# Altium project clock_led.PrjPcb
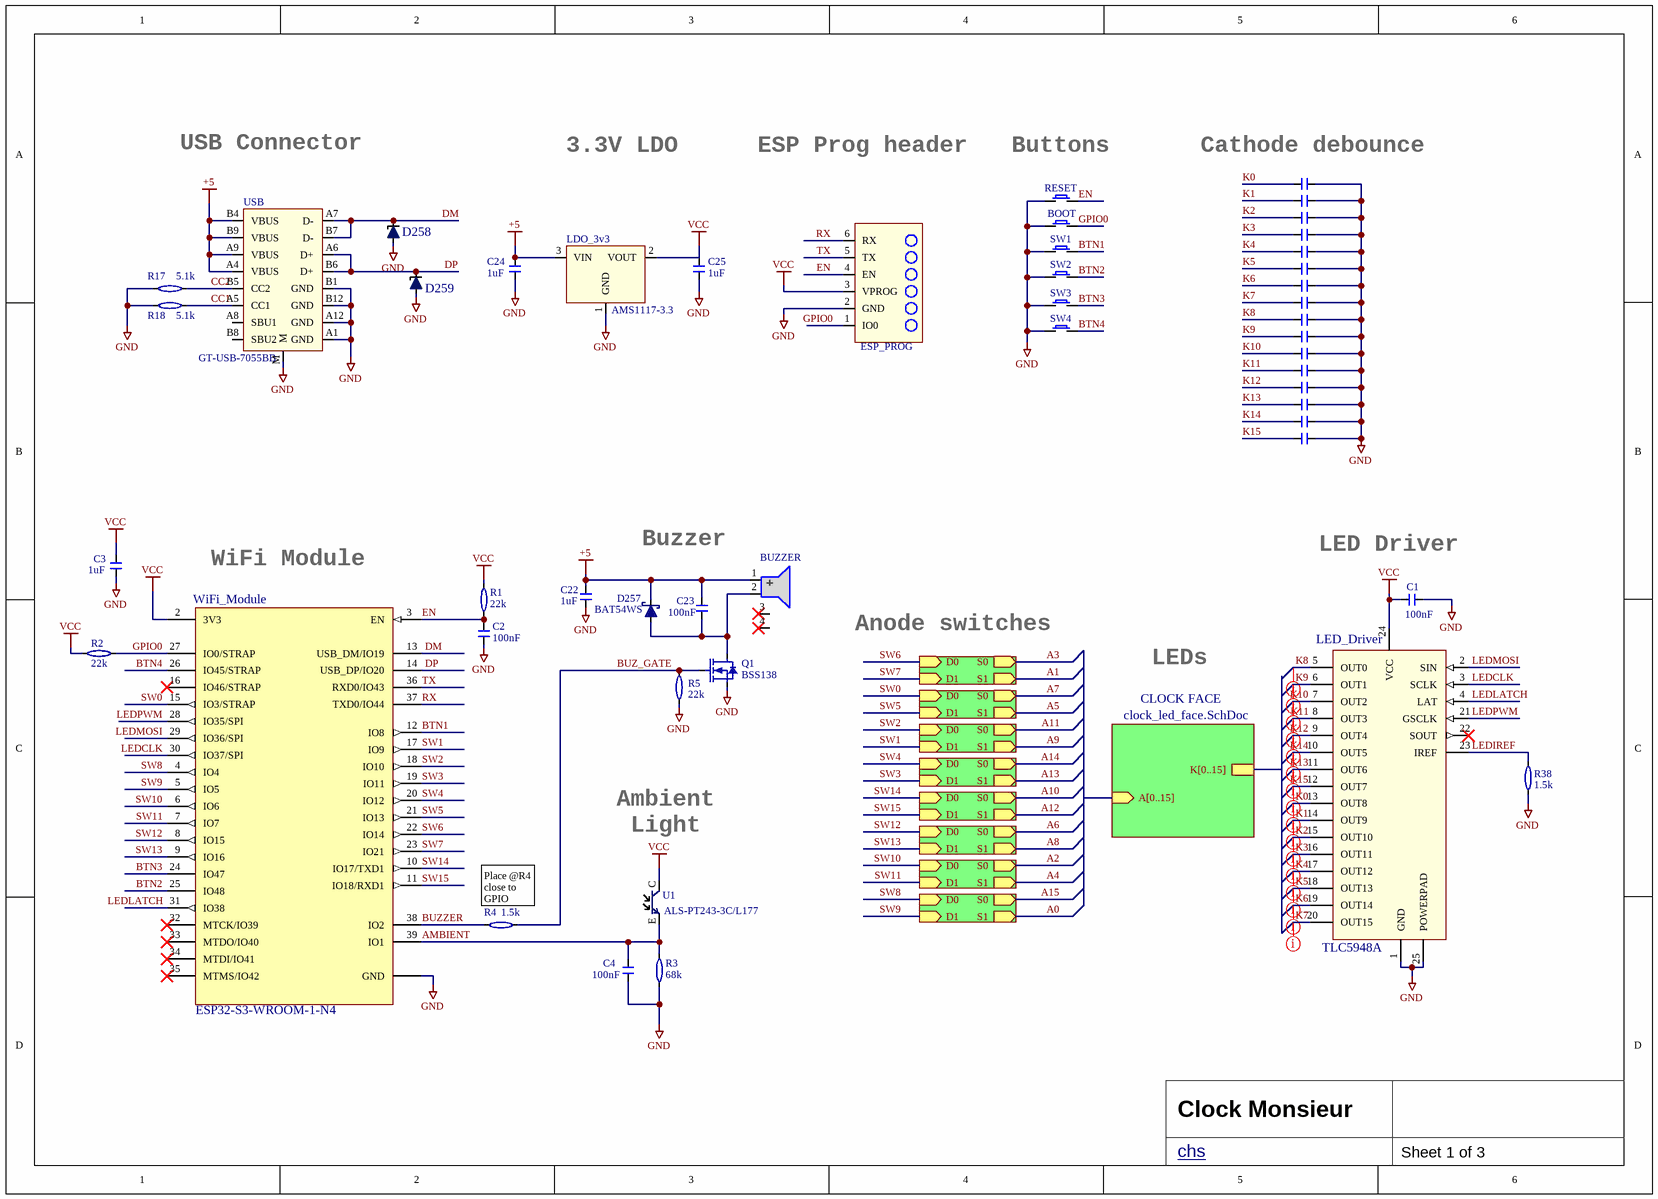
[diagram p0: clock_led.SchDoc]
3 sheets, 321 parts. Net scope: hierarchical (ports join the sheet entries above them; power ports are global).
Board files: clock_led.PcbDoc, clock_led_panel.PcbDoc
Sheets:
  clock_led.SchDoc
    CLOCK FACE = clock_led_face.SchDoc
    D = clock_led_dual_switch.SchDoc
    D = clock_led_dual_switch.SchDoc
    D = clock_led_dual_switch.SchDoc
    D = clock_led_dual_switch.SchDoc
    D = clock_led_dual_switch.SchDoc
    D = clock_led_dual_switch.SchDoc
    D = clock_led_dual_switch.SchDoc
    D = clock_led_dual_switch.SchDoc

## Sheet clock_led.SchDoc: Clock Monsieur
size 290 x 209 mm; Author: chs; SheetNumber: 1; SheetTotal: 3

### Parts
BOOT  SW-SMD_YZA-072-7.0  [FSM-SWITCH-6x6x7.0]  (value not drawn)
BUZZER  BUZZER_MLT-7525  [BUZZER_XHXDZ_SMD8530]  (value not drawn)
C1  100nF  [CAPC_0603_1608X08L]
C2  100nF  [CAPC_0603_1608X08L]
C3  1uF  [CAPC_1206_3216X16L]
C4  100nF  [CAPC_0603_1608X08L]
C5  100pF  [CAP_0402]  (value not drawn)
C6  100pF  [CAP_0402]  (value not drawn)
C7  100pF  [CAP_0402]  (value not drawn)
C8  100pF  [CAP_0402]  (value not drawn)
C9  100pF  [CAP_0402]  (value not drawn)
C10  100pF  [CAP_0402]  (value not drawn)
C11  100pF  [CAP_0402]  (value not drawn)
C12  100pF  [CAP_0402]  (value not drawn)
C13  100pF  [CAP_0402]  (value not drawn)
C14  100pF  [CAP_0402]  (value not drawn)
C15  100pF  [CAP_0402]  (value not drawn)
C16  100pF  [CAP_0402]  (value not drawn)
C17  100pF  [CAP_0402]  (value not drawn)
C18  100pF  [CAP_0402]  (value not drawn)
C19  100pF  [CAP_0402]  (value not drawn)
C20  100pF  [CAP_0402]  (value not drawn)
C22  1uF  [CAPC_1206_3216X16L]
C23  100nF  [CAPC_0603_1608X08L]
C24  1uF  [CAPC_1206_3216X16L]
C25  1uF  [CAPC_1206_3216X16L]
D257  BAT54WS  [SODFL250X100-2L]
D258  TVS_DIODE  [TVS_DIODE]  (value not drawn)
D259  TVS_DIODE  [TVS_DIODE]  (value not drawn)
ESP_PROG  ESP_PROG  [ESP_PROG]  (value not drawn)  (no BOM)
LDO_3v3  AMS1117-3.3  [SOT223_LDO]
LED_Driver  TLC5948A  [TSSOP24]
Q1  BSS138  [SOT95P230X110-3L]
R1  22k  [RES 0402_1005 RF]
R2  22k  [RES 0402_1005 RF]
R3  68k  [RES 0402_1005 RF]
R4  1.5k  [RES 0402_1005 RF]
R5  22k  [RES 0402_1005 RF]
R17  5.1k  [RES 0402_1005 RF]
R18  5.1k  [RES 0402_1005 RF]
R38  1.5k  [RES 0402_1005 RF]
RESET  SW-SMD_YZA-072-5.5  [FSM-SWITCH-6x6x5.5]  (value not drawn)
SW1  SW-SMD_YZA-072-7.0  [FSM-SWITCH-6x6x7.0]  (value not drawn)
SW2  SW-SMD_YZA-072-7.0  [FSM-SWITCH-6x6x7.0]  (value not drawn)
SW3  SW-SMD_YZA-072-7.0  [FSM-SWITCH-6x6x7.0]  (value not drawn)
SW4  SW-SMD_YZA-072-7.0  [FSM-SWITCH-6x6x7.0]  (value not drawn)
U1  ALS-PT243-3C/L177  [ALS-PT243-3C]  (no BOM)
USB  GT-USB-7055BB  [USB-C-TH_GT-USB-7055BB]
WiFi_Module  ESP32-S3-WROOM-1-N4  [XCVR_ESP32-S3-WROOM-1-N16R2]

### Sub-sheets
CLOCK FACE = clock_led_face.SchDoc: A[0..15] (in), K[0..15]
D = clock_led_dual_switch.SchDoc: D0 (in), D1 (in), S0 (out), S1 (out)
D = clock_led_dual_switch.SchDoc: D0 (in), D1 (in), S0 (out), S1 (out)
D = clock_led_dual_switch.SchDoc: D0 (in), D1 (in), S0 (out), S1 (out)
D = clock_led_dual_switch.SchDoc: D0 (in), D1 (in), S0 (out), S1 (out)
D = clock_led_dual_switch.SchDoc: D0 (in), D1 (in), S0 (out), S1 (out)
D = clock_led_dual_switch.SchDoc: D0 (in), D1 (in), S0 (out), S1 (out)
D = clock_led_dual_switch.SchDoc: D0 (in), D1 (in), S0 (out), S1 (out)
D = clock_led_dual_switch.SchDoc: D0 (in), D1 (in), S0 (out), S1 (out)

### Nets
+5: BUZZER.1(VCC) C22.1 C23.1 C24.2 D257.K LDO_3v3.3(VIN) USB.A4(VBUS) USB.A9(VBUS) USB.B4(VBUS) USB.B9(VBUS)
GND: BOOT.1(A) C1.1 C2.2 C3.2 C4.2 C5.1 C6.1 C7.1 C8.1 C9.1 C10.1 C11.1 C12.1 C13.1 C14.1 C15.1 C16.1 C17.1 C18.1 C19.1 C20.1 C22.2 C24.1 C25.2 D258.A D259.A ESP_PROG.2(GND) LDO_3v3.1(GND) LED_Driver.1(GND) LED_Driver.25(POWERPAD) Q1.S R3.2 R5.2 R17.2 R18.2 R38.2 RESET.1(A) SW1.1(A) SW2.1(A) SW3.1(A) SW4.1(A) USB.A1(GND) USB.A12(GND) USB.B1(GND) USB.B12(GND) USB.M WiFi_Module.GND
VCC: C1.2 C3.1 C25.1 ESP_PROG.3(VPROG) LDO_3v3.2(VOUT) LED_Driver.24(VCC) R1.1 R2.1 U1.C WiFi_Module.2(3V3)
AMBIENT: C4.1 R3.1 U1.E WiFi_Module.39(IO1)
BTN1: SW1.2(B) WiFi_Module.12(IO8)
BTN2: SW2.2(B) WiFi_Module.25(IO48)
BTN3: SW3.2(B) WiFi_Module.24(IO47)
BTN4: SW4.2(B) WiFi_Module.26(IO45/STRAP)
BUZ_GATE: Q1.G R4.1 R5.1
BUZZER: R4.2 WiFi_Module.38(IO2)
CC1: R18.1 USB.A5(CC1)
CC2: R17.1 USB.B5(CC2)
DM: D258.K USB.A7(D-) USB.B7(D-) WiFi_Module.13(USB_DM/IO19)
DP: D259.K USB.A6(D+) USB.B6(D+) WiFi_Module.14(USB_DP/IO20)
EN: C2.1 ESP_PROG.4(EN) R1.2 RESET.2(B) WiFi_Module.3(EN)
GPIO0: BOOT.2(B) ESP_PROG.1(IO0) R2.2 WiFi_Module.27(IO0/STRAP)
K0: C5.2 LED_Driver.13(OUT8)
K1: C6.2 LED_Driver.14(OUT9)
K2: C7.2 LED_Driver.15(OUT10)
K3: C8.2 LED_Driver.16(OUT11)
K4: C9.2 LED_Driver.17(OUT12)
K5: C10.2 LED_Driver.18(OUT13)
K6: C11.2 LED_Driver.19(OUT14)
K7: C12.2 LED_Driver.20(OUT15)
K8: C13.2 LED_Driver.5(OUT0)
K9: C14.2 LED_Driver.6(OUT1)
K10: C15.2 LED_Driver.7(OUT2)
K11: C16.2 LED_Driver.8(OUT3)
K12: C17.2 LED_Driver.9(OUT4)
K13: C18.2 LED_Driver.11(OUT6)
K14: C19.2 LED_Driver.10(OUT5)
K15: C20.2 LED_Driver.12(OUT7)
LEDCLK: LED_Driver.3(SCLK) WiFi_Module.30(IO37/SPI)
LEDIREF: LED_Driver.23(IREF) R38.1
LEDLATCH: LED_Driver.4(LAT) WiFi_Module.31(IO38)
LEDMOSI: LED_Driver.2(SIN) WiFi_Module.29(IO36/SPI)
LEDPWM: LED_Driver.21(GSCLK) WiFi_Module.28(IO35/SPI)
RX: ESP_PROG.6(RX) WiFi_Module.37(TXD0/IO44)
SW0: WiFi_Module.15(IO3/STRAP) ; sheet D/D0
SW1: WiFi_Module.17(IO9) ; sheet D/D1
SW2: WiFi_Module.18(IO10) ; sheet D/D0
SW3: WiFi_Module.19(IO11) ; sheet D/D1
SW4: WiFi_Module.20(IO12) ; sheet D/D0
SW5: WiFi_Module.21(IO13) ; sheet D/D1
SW6: WiFi_Module.22(IO14) ; sheet D/D0
SW7: WiFi_Module.23(IO21) ; sheet D/D1
SW8: WiFi_Module.4(IO4) ; sheet D/D0
SW9: WiFi_Module.5(IO5) ; sheet D/D1
SW10: WiFi_Module.6(IO6) ; sheet D/D0
SW11: WiFi_Module.7(IO7) ; sheet D/D1
SW12: WiFi_Module.8(IO15) ; sheet D/D0
SW13: WiFi_Module.9(IO16) ; sheet D/D1
SW14: WiFi_Module.10(IO17/TXD1) ; sheet D/D0
SW15: WiFi_Module.11(IO18/RXD1) ; sheet D/D1
TX: ESP_PROG.5(TX) WiFi_Module.36(RXD0/IO43)
NetBUZZER_2: BUZZER.2(GND) C23.2 D257.A Q1.D

Not connected (* = marked no-connect by the designer): BUZZER 3(DNC)* 4(DNC)*; LED_Driver 22(SOUT)*; USB A8(SBU1) B8(SBU2); WiFi_Module 16(IO46/STRAP)* 32(MTCK/IO39)* 33(MTDO/IO40)* 34(MTDI/IO41)* 35(MTMS/IO42)*

### Layout directives
net class CATHODES: K0, K1, K2, K3, K4, K5, K6, K7, K8, K9, K10, K11, K12, K13, K14, K15

### Notes on the sheet
- USB Connector
- 3.3V LDO
- ESP Prog header
- Buttons
- Cathode debounce
- (near WiFi_Module) WiFi Module
- Buzzer
- (near C1) LED Driver
- Anode switches
- LEDs
- Ambient Light Sensor
- (near R4) Place @R4 close to GPIO

### Library data of the parts
BOOT SW1-SW4 = SW-SMD_YZA-072-7.0: 5.2x5.2x1.2mm Tactile Switch; JLCPCB: C722968
C1 C4 C23 = CAP_0603_100nF: Ceramic capacitor 0603; Value: 100nF; JLCPCB: C7501158
C2 = CAP_0402_100nF: Ceramic capacitor 0402; Value: 100nF; JLCPCB: C7501158
C3 C22 C24 C25 = CAP_1206_1uF: Ceramic capacitor 1206; Value: 1uF; JLCPCB: C5448921
C5-C20 = CAP_0402_100pF: Ceramic capacitor 0402; Value: 100pF; JLCPCB: C1546
D257 = BAT54WS: Schottky Diode 20v 500mA; JLCPCB: C27636123
D258 D259 = TVS_DIODE: TVS Diode; JLCPCB: C151980
LDO_3v3 = AMS1117-3.3: 3.3V LDO; JLCPCB: C18906017
LED_Driver = TLC5948: 16 Channel CC Led Driver; JLCPCB: C702084
Q1 = BSS138: P channel mosfet 1.2A; JLCPCB: C3015220
R1 R2 R5 = RES_0402_22k: Chip Resistor; Value: 22k; JLCPCB: C2906913
R3 = RES_0402_68k: Chip Resistor; Value: 68k; JLCPCB: C3017593
R4 R38 = RES_0402_1.5k: Chip Resistor; Value: 1.5k; JLCPCB: C2933074
R17 R18 = RES_0402_5.1k: Chip Resistor; Value: 5.1k; JLCPCB: C2906948
RESET = SW-SMD_YZA-072-5.5: 5.2x5.2x1.2mm Tactile Switch; JLCPCB: C722967
U1 = PHOTOTRANSISTOR
USB = GT-USB-7055BB: USB Connector, vertical; JLCPCB: C7450621
WiFi_Module = ESP32-S3-WROOM-1-N4: ESP32 Module, 4MB Flash, No PSRAM; JLCPCB: C2913197
BUZZER = BUZZER_MLT-7525: JLCPCB: C95299

## Sheet clock_led_face.SchDoc: Display
size 290 x 209 mm; Author: chs; SheetNumber: 3; SheetTotal: 3
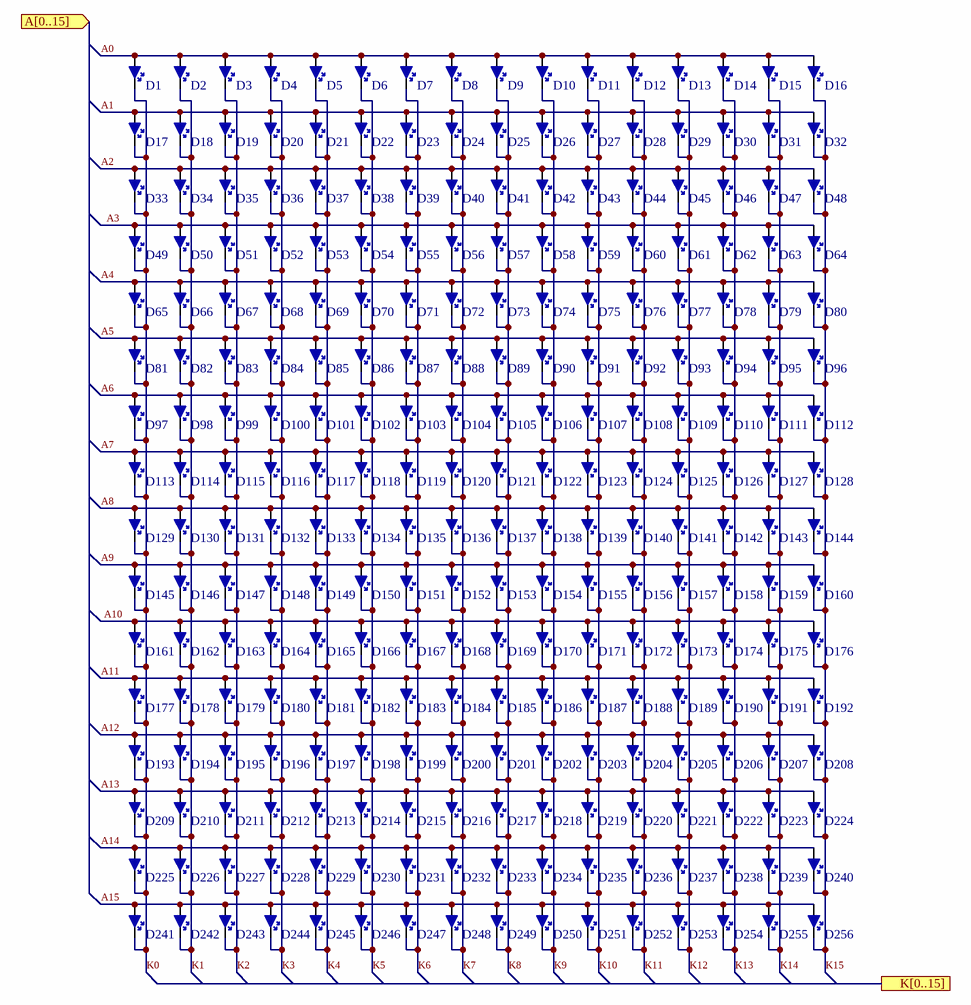
[diagram p1: clock_led_face.SchDoc]

### Parts
D1  LED  [LED_0402]  (value not drawn)
D2  LED  [LED_0402]  (value not drawn)
D3  LED  [LED_0402]  (value not drawn)
D4  LED  [LED_0402]  (value not drawn)
D5  LED  [LED_0402]  (value not drawn)
D6  LED  [LED_0402]  (value not drawn)
D7  LED  [LED_0402]  (value not drawn)
D8  LED  [LED_0402]  (value not drawn)
D9  LED  [LED_0402]  (value not drawn)
D10  LED  [LED_0402]  (value not drawn)
D11  LED  [LED_0402]  (value not drawn)
D12  LED  [LED_0402]  (value not drawn)
D13  LED  [LED_0402]  (value not drawn)
D14  LED  [LED_0402]  (value not drawn)
D15  LED  [LED_0402]  (value not drawn)
D16  LED  [LED_0402]  (value not drawn)
D17  LED  [LED_0402]  (value not drawn)
D18  LED  [LED_0402]  (value not drawn)
D19  LED  [LED_0402]  (value not drawn)
D20  LED  [LED_0402]  (value not drawn)
D21  LED  [LED_0402]  (value not drawn)
D22  LED  [LED_0402]  (value not drawn)
D23  LED  [LED_0402]  (value not drawn)
D24  LED  [LED_0402]  (value not drawn)
D25  LED  [LED_0402]  (value not drawn)
D26  LED  [LED_0402]  (value not drawn)
D27  LED  [LED_0402]  (value not drawn)
D28  LED  [LED_0402]  (value not drawn)
D29  LED  [LED_0402]  (value not drawn)
D30  LED  [LED_0402]  (value not drawn)
D31  LED  [LED_0402]  (value not drawn)
D32  LED  [LED_0402]  (value not drawn)
D33  LED  [LED_0402]  (value not drawn)
D34  LED  [LED_0402]  (value not drawn)
D35  LED  [LED_0402]  (value not drawn)
D36  LED  [LED_0402]  (value not drawn)
D37  LED  [LED_0402]  (value not drawn)
D38  LED  [LED_0402]  (value not drawn)
D39  LED  [LED_0402]  (value not drawn)
D40  LED  [LED_0402]  (value not drawn)
D41  LED  [LED_0402]  (value not drawn)
D42  LED  [LED_0402]  (value not drawn)
D43  LED  [LED_0402]  (value not drawn)
D44  LED  [LED_0402]  (value not drawn)
D45  LED  [LED_0402]  (value not drawn)
D46  LED  [LED_0402]  (value not drawn)
D47  LED  [LED_0402]  (value not drawn)
D48  LED  [LED_0402]  (value not drawn)
D49  LED  [LED_0402]  (value not drawn)
D50  LED  [LED_0402]  (value not drawn)
D51  LED  [LED_0402]  (value not drawn)
D52  LED  [LED_0402]  (value not drawn)
D53  LED  [LED_0402]  (value not drawn)
D54  LED  [LED_0402]  (value not drawn)
D55  LED  [LED_0402]  (value not drawn)
D56  LED  [LED_0402]  (value not drawn)
D57  LED  [LED_0402]  (value not drawn)
D58  LED  [LED_0402]  (value not drawn)
D59  LED  [LED_0402]  (value not drawn)
D60  LED  [LED_0402]  (value not drawn)
D61  LED  [LED_0402]  (value not drawn)
D62  LED  [LED_0402]  (value not drawn)
D63  LED  [LED_0402]  (value not drawn)
D64  LED  [LED_0402]  (value not drawn)
D65  LED  [LED_0402]  (value not drawn)
D66  LED  [LED_0402]  (value not drawn)
D67  LED  [LED_0402]  (value not drawn)
D68  LED  [LED_0402]  (value not drawn)
D69  LED  [LED_0402]  (value not drawn)
D70  LED  [LED_0402]  (value not drawn)
D71  LED  [LED_0402]  (value not drawn)
D72  LED  [LED_0402]  (value not drawn)
D73  LED  [LED_0402]  (value not drawn)
D74  LED  [LED_0402]  (value not drawn)
D75  LED  [LED_0402]  (value not drawn)
D76  LED  [LED_0402]  (value not drawn)
D77  LED  [LED_0402]  (value not drawn)
D78  LED  [LED_0402]  (value not drawn)
D79  LED  [LED_0402]  (value not drawn)
D80  LED  [LED_0402]  (value not drawn)
D81  LED  [LED_0402]  (value not drawn)
D82  LED  [LED_0402]  (value not drawn)
D83  LED  [LED_0402]  (value not drawn)
D84  LED  [LED_0402]  (value not drawn)
D85  LED  [LED_0402]  (value not drawn)
D86  LED  [LED_0402]  (value not drawn)
D87  LED  [LED_0402]  (value not drawn)
D88  LED  [LED_0402]  (value not drawn)
D89  LED  [LED_0402]  (value not drawn)
D90  LED  [LED_0402]  (value not drawn)
D91  LED  [LED_0402]  (value not drawn)
D92  LED  [LED_0402]  (value not drawn)
D93  LED  [LED_0402]  (value not drawn)
D94  LED  [LED_0402]  (value not drawn)
D95  LED  [LED_0402]  (value not drawn)
D96  LED  [LED_0402]  (value not drawn)
D97  LED  [LED_0402]  (value not drawn)
D98  LED  [LED_0402]  (value not drawn)
D99  LED  [LED_0402]  (value not drawn)
D100  LED  [LED_0402]  (value not drawn)
D101  LED  [LED_0402]  (value not drawn)
D102  LED  [LED_0402]  (value not drawn)
D103  LED  [LED_0402]  (value not drawn)
D104  LED  [LED_0402]  (value not drawn)
D105  LED  [LED_0402]  (value not drawn)
D106  LED  [LED_0402]  (value not drawn)
D107  LED  [LED_0402]  (value not drawn)
D108  LED  [LED_0402]  (value not drawn)
D109  LED  [LED_0402]  (value not drawn)
D110  LED  [LED_0402]  (value not drawn)
D111  LED  [LED_0402]  (value not drawn)
D112  LED  [LED_0402]  (value not drawn)
D113  LED  [LED_0402]  (value not drawn)
D114  LED  [LED_0402]  (value not drawn)
D115  LED  [LED_0402]  (value not drawn)
D116  LED  [LED_0402]  (value not drawn)
D117  LED  [LED_0402]  (value not drawn)
D118  LED  [LED_0402]  (value not drawn)
D119  LED  [LED_0402]  (value not drawn)
D120  LED  [LED_0402]  (value not drawn)
D121  LED  [LED_0402]  (value not drawn)
D122  LED  [LED_0402]  (value not drawn)
D123  LED  [LED_0402]  (value not drawn)
D124  LED  [LED_0402]  (value not drawn)
D125  LED  [LED_0402]  (value not drawn)
D126  LED  [LED_0402]  (value not drawn)
D127  LED  [LED_0402]  (value not drawn)
D128  LED  [LED_0402]  (value not drawn)
D129  LED  [LED_0402]  (value not drawn)
D130  LED  [LED_0402]  (value not drawn)
D131  LED  [LED_0402]  (value not drawn)
D132  LED  [LED_0402]  (value not drawn)
D133  LED  [LED_0402]  (value not drawn)
D134  LED  [LED_0402]  (value not drawn)
D135  LED  [LED_0402]  (value not drawn)
D136  LED  [LED_0402]  (value not drawn)
D137  LED  [LED_0402]  (value not drawn)
D138  LED  [LED_0402]  (value not drawn)
D139  LED  [LED_0402]  (value not drawn)
D140  LED  [LED_0402]  (value not drawn)
D141  LED  [LED_0402]  (value not drawn)
D142  LED  [LED_0402]  (value not drawn)
D143  LED  [LED_0402]  (value not drawn)
D144  LED  [LED_0402]  (value not drawn)
D145  LED  [LED_0402]  (value not drawn)
D146  LED  [LED_0402]  (value not drawn)
D147  LED  [LED_0402]  (value not drawn)
D148  LED  [LED_0402]  (value not drawn)
D149  LED  [LED_0402]  (value not drawn)
D150  LED  [LED_0402]  (value not drawn)
D151  LED  [LED_0402]  (value not drawn)
D152  LED  [LED_0402]  (value not drawn)
D153  LED  [LED_0402]  (value not drawn)
D154  LED  [LED_0402]  (value not drawn)
D155  LED  [LED_0402]  (value not drawn)
D156  LED  [LED_0402]  (value not drawn)
D157  LED  [LED_0402]  (value not drawn)
D158  LED  [LED_0402]  (value not drawn)
D159  LED  [LED_0402]  (value not drawn)
D160  LED  [LED_0402]  (value not drawn)
D161  LED  [LED_0402]  (value not drawn)
D162  LED  [LED_0402]  (value not drawn)
D163  LED  [LED_0402]  (value not drawn)
D164  LED  [LED_0402]  (value not drawn)
D165  LED  [LED_0402]  (value not drawn)
D166  LED  [LED_0402]  (value not drawn)
D167  LED  [LED_0402]  (value not drawn)
D168  LED  [LED_0402]  (value not drawn)
D169  LED  [LED_0402]  (value not drawn)
D170  LED  [LED_0402]  (value not drawn)
D171  LED  [LED_0402]  (value not drawn)
D172  LED  [LED_0402]  (value not drawn)
D173  LED  [LED_0402]  (value not drawn)
D174  LED  [LED_0402]  (value not drawn)
D175  LED  [LED_0402]  (value not drawn)
D176  LED  [LED_0402]  (value not drawn)
D177  LED  [LED_0402]  (value not drawn)
D178  LED  [LED_0402]  (value not drawn)
D179  LED  [LED_0402]  (value not drawn)
D180  LED  [LED_0402]  (value not drawn)
D181  LED  [LED_0402]  (value not drawn)
D182  LED  [LED_0402]  (value not drawn)
D183  LED  [LED_0402]  (value not drawn)
D184  LED  [LED_0402]  (value not drawn)
D185  LED  [LED_0402]  (value not drawn)
D186  LED  [LED_0402]  (value not drawn)
D187  LED  [LED_0402]  (value not drawn)
D188  LED  [LED_0402]  (value not drawn)
D189  LED  [LED_0402]  (value not drawn)
D190  LED  [LED_0402]  (value not drawn)
D191  LED  [LED_0402]  (value not drawn)
D192  LED  [LED_0402]  (value not drawn)
D193  LED  [LED_0402]  (value not drawn)
D194  LED  [LED_0402]  (value not drawn)
D195  LED  [LED_0402]  (value not drawn)
D196  LED  [LED_0402]  (value not drawn)
D197  LED  [LED_0402]  (value not drawn)
D198  LED  [LED_0402]  (value not drawn)
D199  LED  [LED_0402]  (value not drawn)
D200  LED  [LED_0402]  (value not drawn)
D201  LED  [LED_0402]  (value not drawn)
D202  LED  [LED_0402]  (value not drawn)
D203  LED  [LED_0402]  (value not drawn)
D204  LED  [LED_0402]  (value not drawn)
D205  LED  [LED_0402]  (value not drawn)
D206  LED  [LED_0402]  (value not drawn)
D207  LED  [LED_0402]  (value not drawn)
D208  LED  [LED_0402]  (value not drawn)
D209  LED  [LED_0402]  (value not drawn)
D210  LED  [LED_0402]  (value not drawn)
D211  LED  [LED_0402]  (value not drawn)
D212  LED  [LED_0402]  (value not drawn)
D213  LED  [LED_0402]  (value not drawn)
D214  LED  [LED_0402]  (value not drawn)
D215  LED  [LED_0402]  (value not drawn)
D216  LED  [LED_0402]  (value not drawn)
D217  LED  [LED_0402]  (value not drawn)
D218  LED  [LED_0402]  (value not drawn)
D219  LED  [LED_0402]  (value not drawn)
D220  LED  [LED_0402]  (value not drawn)
D221  LED  [LED_0402]  (value not drawn)
D222  LED  [LED_0402]  (value not drawn)
D223  LED  [LED_0402]  (value not drawn)
D224  LED  [LED_0402]  (value not drawn)
D225  LED  [LED_0402]  (value not drawn)
D226  LED  [LED_0402]  (value not drawn)
D227  LED  [LED_0402]  (value not drawn)
D228  LED  [LED_0402]  (value not drawn)
D229  LED  [LED_0402]  (value not drawn)
D230  LED  [LED_0402]  (value not drawn)
D231  LED  [LED_0402]  (value not drawn)
D232  LED  [LED_0402]  (value not drawn)
D233  LED  [LED_0402]  (value not drawn)
D234  LED  [LED_0402]  (value not drawn)
D235  LED  [LED_0402]  (value not drawn)
D236  LED  [LED_0402]  (value not drawn)
D237  LED  [LED_0402]  (value not drawn)
D238  LED  [LED_0402]  (value not drawn)
D239  LED  [LED_0402]  (value not drawn)
D240  LED  [LED_0402]  (value not drawn)
D241  LED  [LED_0402]  (value not drawn)
D242  LED  [LED_0402]  (value not drawn)
D243  LED  [LED_0402]  (value not drawn)
D244  LED  [LED_0402]  (value not drawn)
D245  LED  [LED_0402]  (value not drawn)
D246  LED  [LED_0402]  (value not drawn)
D247  LED  [LED_0402]  (value not drawn)
D248  LED  [LED_0402]  (value not drawn)
D249  LED  [LED_0402]  (value not drawn)
D250  LED  [LED_0402]  (value not drawn)
D251  LED  [LED_0402]  (value not drawn)
D252  LED  [LED_0402]  (value not drawn)
D253  LED  [LED_0402]  (value not drawn)
D254  LED  [LED_0402]  (value not drawn)
D255  LED  [LED_0402]  (value not drawn)
D256  LED  [LED_0402]  (value not drawn)

### Ports
A[0..15] (in), K[0..15]

### Nets
A0: D1.2(A) D2.2(A) D3.2(A) D4.2(A) D5.2(A) D6.2(A) D7.2(A) D8.2(A) D9.2(A) D10.2(A) D11.2(A) D12.2(A) D13.2(A) D14.2(A) D15.2(A) D16.2(A)
A1: D17.2(A) D18.2(A) D19.2(A) D20.2(A) D21.2(A) D22.2(A) D23.2(A) D24.2(A) D25.2(A) D26.2(A) D27.2(A) D28.2(A) D29.2(A) D30.2(A) D31.2(A) D32.2(A)
A2: D33.2(A) D34.2(A) D35.2(A) D36.2(A) D37.2(A) D38.2(A) D39.2(A) D40.2(A) D41.2(A) D42.2(A) D43.2(A) D44.2(A) D45.2(A) D46.2(A) D47.2(A) D48.2(A)
A3: D49.2(A) D50.2(A) D51.2(A) D52.2(A) D53.2(A) D54.2(A) D55.2(A) D56.2(A) D57.2(A) D58.2(A) D59.2(A) D60.2(A) D61.2(A) D62.2(A) D63.2(A) D64.2(A)
A4: D65.2(A) D66.2(A) D67.2(A) D68.2(A) D69.2(A) D70.2(A) D71.2(A) D72.2(A) D73.2(A) D74.2(A) D75.2(A) D76.2(A) D77.2(A) D78.2(A) D79.2(A) D80.2(A)
A5: D81.2(A) D82.2(A) D83.2(A) D84.2(A) D85.2(A) D86.2(A) D87.2(A) D88.2(A) D89.2(A) D90.2(A) D91.2(A) D92.2(A) D93.2(A) D94.2(A) D95.2(A) D96.2(A)
A6: D97.2(A) D98.2(A) D99.2(A) D100.2(A) D101.2(A) D102.2(A) D103.2(A) D104.2(A) D105.2(A) D106.2(A) D107.2(A) D108.2(A) D109.2(A) D110.2(A) D111.2(A) D112.2(A)
A7: D113.2(A) D114.2(A) D115.2(A) D116.2(A) D117.2(A) D118.2(A) D119.2(A) D120.2(A) D121.2(A) D122.2(A) D123.2(A) D124.2(A) D125.2(A) D126.2(A) D127.2(A) D128.2(A)
A8: D129.2(A) D130.2(A) D131.2(A) D132.2(A) D133.2(A) D134.2(A) D135.2(A) D136.2(A) D137.2(A) D138.2(A) D139.2(A) D140.2(A) D141.2(A) D142.2(A) D143.2(A) D144.2(A)
A9: D145.2(A) D146.2(A) D147.2(A) D148.2(A) D149.2(A) D150.2(A) D151.2(A) D152.2(A) D153.2(A) D154.2(A) D155.2(A) D156.2(A) D157.2(A) D158.2(A) D159.2(A) D160.2(A)
A10: D161.2(A) D162.2(A) D163.2(A) D164.2(A) D165.2(A) D166.2(A) D167.2(A) D168.2(A) D169.2(A) D170.2(A) D171.2(A) D172.2(A) D173.2(A) D174.2(A) D175.2(A) D176.2(A)
A11: D177.2(A) D178.2(A) D179.2(A) D180.2(A) D181.2(A) D182.2(A) D183.2(A) D184.2(A) D185.2(A) D186.2(A) D187.2(A) D188.2(A) D189.2(A) D190.2(A) D191.2(A) D192.2(A)
A12: D193.2(A) D194.2(A) D195.2(A) D196.2(A) D197.2(A) D198.2(A) D199.2(A) D200.2(A) D201.2(A) D202.2(A) D203.2(A) D204.2(A) D205.2(A) D206.2(A) D207.2(A) D208.2(A)
A13: D209.2(A) D210.2(A) D211.2(A) D212.2(A) D213.2(A) D214.2(A) D215.2(A) D216.2(A) D217.2(A) D218.2(A) D219.2(A) D220.2(A) D221.2(A) D222.2(A) D223.2(A) D224.2(A)
A14: D225.2(A) D226.2(A) D227.2(A) D228.2(A) D229.2(A) D230.2(A) D231.2(A) D232.2(A) D233.2(A) D234.2(A) D235.2(A) D236.2(A) D237.2(A) D238.2(A) D239.2(A) D240.2(A)
A15: D241.2(A) D242.2(A) D243.2(A) D244.2(A) D245.2(A) D246.2(A) D247.2(A) D248.2(A) D249.2(A) D250.2(A) D251.2(A) D252.2(A) D253.2(A) D254.2(A) D255.2(A) D256.2(A)
K0: D1.1(C) D17.1(C) D33.1(C) D49.1(C) D65.1(C) D81.1(C) D97.1(C) D113.1(C) D129.1(C) D145.1(C) D161.1(C) D177.1(C) D193.1(C) D209.1(C) D225.1(C) D241.1(C)
K1: D2.1(C) D18.1(C) D34.1(C) D50.1(C) D66.1(C) D82.1(C) D98.1(C) D114.1(C) D130.1(C) D146.1(C) D162.1(C) D178.1(C) D194.1(C) D210.1(C) D226.1(C) D242.1(C)
K2: D3.1(C) D19.1(C) D35.1(C) D51.1(C) D67.1(C) D83.1(C) D99.1(C) D115.1(C) D131.1(C) D147.1(C) D163.1(C) D179.1(C) D195.1(C) D211.1(C) D227.1(C) D243.1(C)
K3: D4.1(C) D20.1(C) D36.1(C) D52.1(C) D68.1(C) D84.1(C) D100.1(C) D116.1(C) D132.1(C) D148.1(C) D164.1(C) D180.1(C) D196.1(C) D212.1(C) D228.1(C) D244.1(C)
K4: D5.1(C) D21.1(C) D37.1(C) D53.1(C) D69.1(C) D85.1(C) D101.1(C) D117.1(C) D133.1(C) D149.1(C) D165.1(C) D181.1(C) D197.1(C) D213.1(C) D229.1(C) D245.1(C)
K5: D6.1(C) D22.1(C) D38.1(C) D54.1(C) D70.1(C) D86.1(C) D102.1(C) D118.1(C) D134.1(C) D150.1(C) D166.1(C) D182.1(C) D198.1(C) D214.1(C) D230.1(C) D246.1(C)
K6: D7.1(C) D23.1(C) D39.1(C) D55.1(C) D71.1(C) D87.1(C) D103.1(C) D119.1(C) D135.1(C) D151.1(C) D167.1(C) D183.1(C) D199.1(C) D215.1(C) D231.1(C) D247.1(C)
K7: D8.1(C) D24.1(C) D40.1(C) D56.1(C) D72.1(C) D88.1(C) D104.1(C) D120.1(C) D136.1(C) D152.1(C) D168.1(C) D184.1(C) D200.1(C) D216.1(C) D232.1(C) D248.1(C)
K8: D9.1(C) D25.1(C) D41.1(C) D57.1(C) D73.1(C) D89.1(C) D105.1(C) D121.1(C) D137.1(C) D153.1(C) D169.1(C) D185.1(C) D201.1(C) D217.1(C) D233.1(C) D249.1(C)
K9: D10.1(C) D26.1(C) D42.1(C) D58.1(C) D74.1(C) D90.1(C) D106.1(C) D122.1(C) D138.1(C) D154.1(C) D170.1(C) D186.1(C) D202.1(C) D218.1(C) D234.1(C) D250.1(C)
K10: D11.1(C) D27.1(C) D43.1(C) D59.1(C) D75.1(C) D91.1(C) D107.1(C) D123.1(C) D139.1(C) D155.1(C) D171.1(C) D187.1(C) D203.1(C) D219.1(C) D235.1(C) D251.1(C)
K11: D12.1(C) D28.1(C) D44.1(C) D60.1(C) D76.1(C) D92.1(C) D108.1(C) D124.1(C) D140.1(C) D156.1(C) D172.1(C) D188.1(C) D204.1(C) D220.1(C) D236.1(C) D252.1(C)
K12: D13.1(C) D29.1(C) D45.1(C) D61.1(C) D77.1(C) D93.1(C) D109.1(C) D125.1(C) D141.1(C) D157.1(C) D173.1(C) D189.1(C) D205.1(C) D221.1(C) D237.1(C) D253.1(C)
K13: D14.1(C) D30.1(C) D46.1(C) D62.1(C) D78.1(C) D94.1(C) D110.1(C) D126.1(C) D142.1(C) D158.1(C) D174.1(C) D190.1(C) D206.1(C) D222.1(C) D238.1(C) D254.1(C)
K14: D15.1(C) D31.1(C) D47.1(C) D63.1(C) D79.1(C) D95.1(C) D111.1(C) D127.1(C) D143.1(C) D159.1(C) D175.1(C) D191.1(C) D207.1(C) D223.1(C) D239.1(C) D255.1(C)
K15: D16.1(C) D32.1(C) D48.1(C) D64.1(C) D80.1(C) D96.1(C) D112.1(C) D128.1(C) D144.1(C) D160.1(C) D176.1(C) D192.1(C) D208.1(C) D224.1(C) D240.1(C) D256.1(C)

### Library data of the parts
D1-D256 = LED: Red 0402 SMD LED; JLCPCB: C25503345
  D1-D13 D17-D29 D33-D45 D49-D61 D65-D77 D81-D93 D97-D109 D113-D125 D129-D141 D145-D157 D161-D173 D177-D189 D193-D205 D209-D221: CLassName: LED_MATRIX

## Sheet clock_led_dual_switch.SchDoc: Dual anode switch
size 290 x 209 mm; Author: chs; SheetNumber: 2; SheetTotal: 3
Used 8 times, as channels D, D, D, D, D, D, D, D. Parts and nets are listed once, with the designators drawn on the sheet.
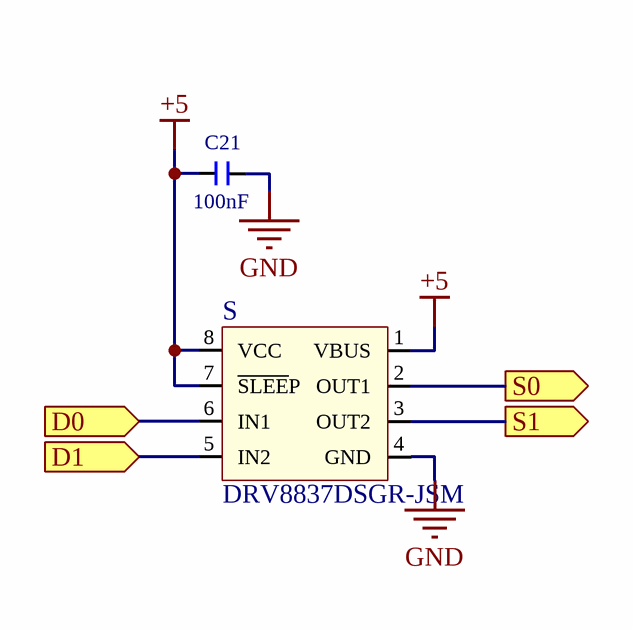
[diagram p2: clock_led_dual_switch.SchDoc]

### Parts
C21  100nF  [CAP_0402]
S  DRV8837DSGR-JSM  [DFN-8-2x2-TP]

### Ports
D0 (in), D1 (in), S0 (out), S1 (out)

### Nets
+5: C21.1 S.1(VBUS) S.7(~{SLEE}P) S.8(VCC)
GND: C21.2 S.4(GND)
D0: S.6(IN1) ; port D0
D1: S.5(IN2) ; port D1
S0: S.2(OUT1) ; port S0
S1: S.3(OUT2) ; port S1

### Channels
D: designators end in _D8; ports D0=SW6 D1=SW7 S0=A3 S1=A1
D: designators end in _D7; ports D0=SW0 D1=SW5 S0=A7 S1=A5
D: designators end in _D6; ports D0=SW2 D1=SW1 S0=A11 S1=A9
D: designators end in _D5; ports D0=SW4 D1=SW3 S0=A14 S1=A13
D: designators end in _D4; ports D0=SW14 D1=SW15 S0=A10 S1=A12
D: designators end in _D3; ports D0=SW12 D1=SW13 S0=A6 S1=A8
D: designators end in _D2; ports D0=SW10 D1=SW11 S0=A2 S1=A4
D: designators end in _D1; ports D0=SW8 D1=SW9 S0=A15 S1=A0

### Library data of the parts
C21 = CAP_0402_100nF: Ceramic capacitor 0402; Value: 100nF; JLCPCB: ????
S = DRV8837DSGR-JSM: JLCPCB: C22447132

## Nets that join several sheets
+5: clock_led (10 pins), D (C21_D8.1 S_D8.1 S_D8.7 S_D8.8), D (C21_D7.1 S_D7.1 S_D7.7 S_D7.8), D (C21_D6.1 S_D6.1 S_D6.7 S_D6.8), D (C21_D5.1 S_D5.1 S_D5.7 S_D5.8), D (C21_D4.1 S_D4.1 S_D4.7 S_D4.8), D (C21_D3.1 S_D3.1 S_D3.7 S_D3.8), D (C21_D2.1 S_D2.1 S_D2.7 S_D2.8), D (C21_D1.1 S_D1.1 S_D1.7 S_D1.8)
GND: clock_led (47 pins), D (C21_D8.2 S_D8.4), D (C21_D7.2 S_D7.4), D (C21_D6.2 S_D6.4), D (C21_D5.2 S_D5.4), D (C21_D4.2 S_D4.4), D (C21_D3.2 S_D3.4), D (C21_D2.2 S_D2.4), D (C21_D1.2 S_D1.4)
SW0: clock_led (WiFi_Module.15), D (S_D7.6)
SW1: clock_led (WiFi_Module.17), D (S_D6.5)
SW2: clock_led (WiFi_Module.18), D (S_D6.6)
SW3: clock_led (WiFi_Module.19), D (S_D5.5)
SW4: clock_led (WiFi_Module.20), D (S_D5.6)
SW5: clock_led (WiFi_Module.21), D (S_D7.5)
SW6: clock_led (WiFi_Module.22), D (S_D8.6)
SW7: clock_led (WiFi_Module.23), D (S_D8.5)
SW8: clock_led (WiFi_Module.4), D (S_D1.6)
SW9: clock_led (WiFi_Module.5), D (S_D1.5)
SW10: clock_led (WiFi_Module.6), D (S_D2.6)
SW11: clock_led (WiFi_Module.7), D (S_D2.5)
SW12: clock_led (WiFi_Module.8), D (S_D3.6)
SW13: clock_led (WiFi_Module.9), D (S_D3.5)
SW14: clock_led (WiFi_Module.10), D (S_D4.6)
SW15: clock_led (WiFi_Module.11), D (S_D4.5)